# Altium schematic sheet MainCircuit.SchDoc: Bidirectional DC/DC Interleaved Buck Converter
size A3; DocumentNumber: 1; Revision: 1.1; SheetNumber: 1; SheetTotal: 6
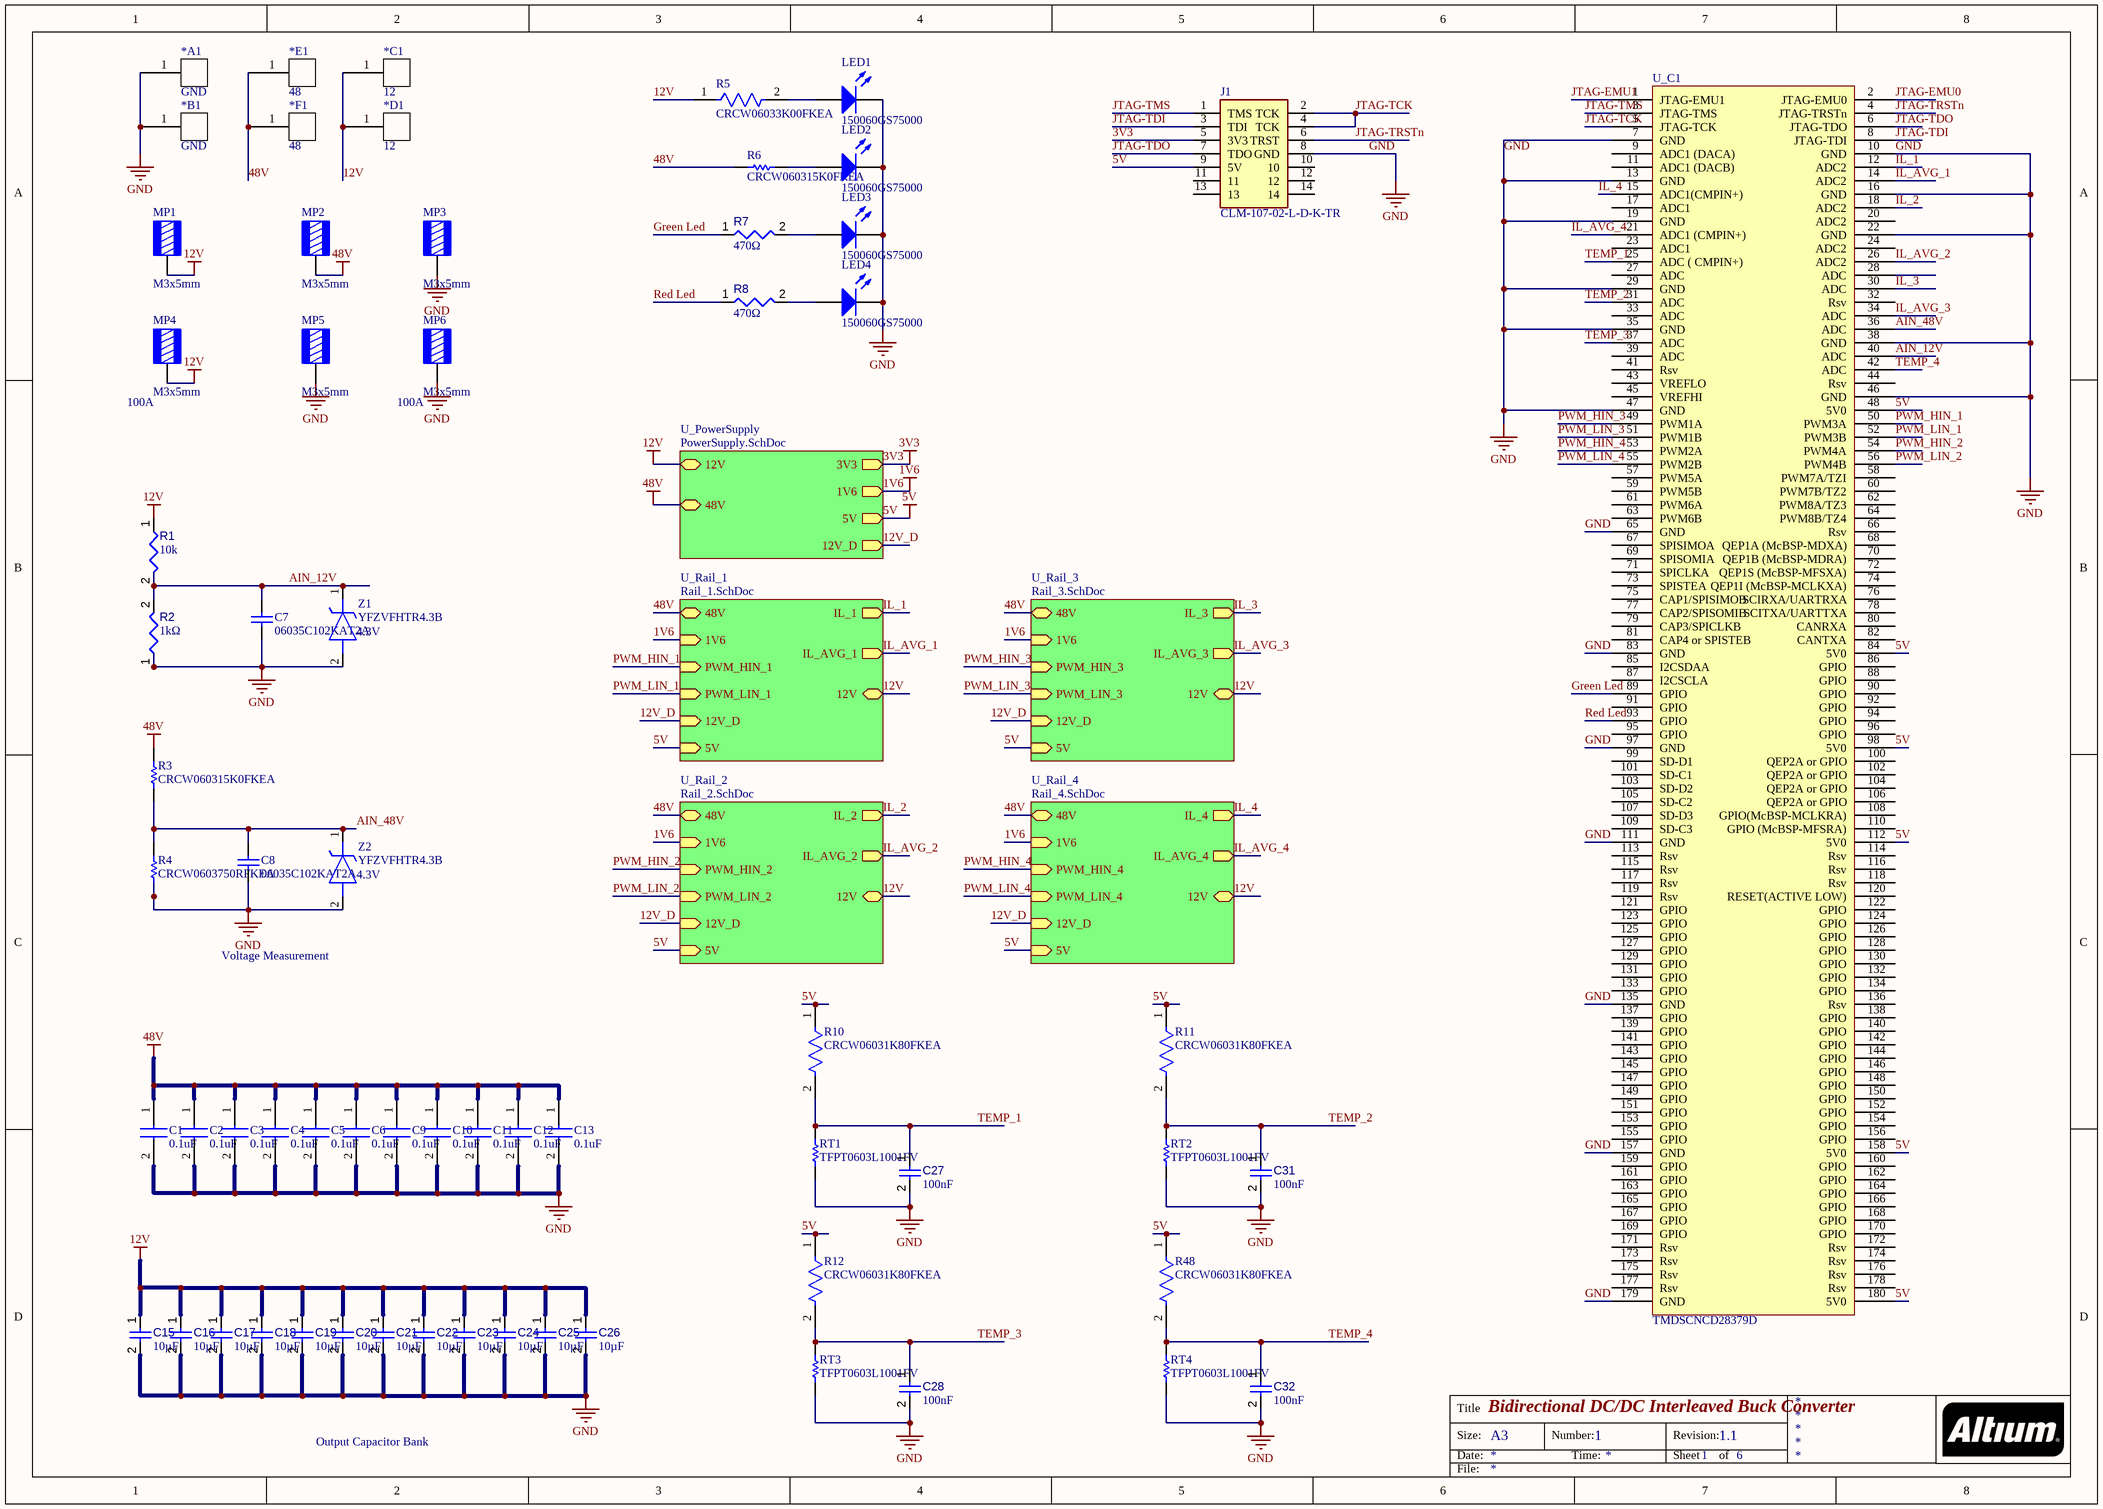
[diagram p0: MainCircuit.SchDoc]

## Parts
*A1  GND
*B1  GND
*C1  12
*D1  12
*E1  48
*F1  48
C1  0.1uF  [CAPC1608X90N]
C2  0.1uF  [CAPC1608X90N]
C3  0.1uF  [CAPC1608X90N]
C4  0.1uF  [CAPC1608X90N]
C5  0.1uF  [CAPC1608X90N]
C6  0.1uF  [CAPC1608X90N]
C7  06035C102KAT2A  [CAPC1608X90X35LL15T15]
C8  06035C102KAT2A  [CAPC1608X90X35LL15T15]
C9  0.1uF  [CAPC1608X90N]
C10  0.1uF  [CAPC1608X90N]
C11  0.1uF  [CAPC1608X90N]
C12  0.1uF  [CAPC1608X90N]
C13  0.1uF  [CAPC1608X90N]
C15  value 10µF  [CAPC0805(2012)145_L]  (hidden comment: Capacitor 10µF +/-20% 25V 0805)
C16  value 10µF  [CAPC0805(2012)145_L]  (hidden comment: Capacitor 10µF +/-20% 25V 0805)
C17  value 10µF  [CAPC0805(2012)145_L]  (hidden comment: Capacitor 10µF +/-20% 25V 0805)
C18  value 10µF  [CAPC0805(2012)145_L]  (hidden comment: Capacitor 10µF +/-20% 25V 0805)
C19  value 10µF  [CAPC0805(2012)145_L]  (hidden comment: Capacitor 10µF +/-20% 25V 0805)
C20  value 10µF  [CAPC0805(2012)145_L]  (hidden comment: Capacitor 10µF +/-20% 25V 0805)
C21  value 10µF  [CAPC0805(2012)145_L]  (hidden comment: Capacitor 10µF +/-20% 25V 0805)
C22  value 10µF  [CAPC0805(2012)145_L]  (hidden comment: Capacitor 10µF +/-20% 25V 0805)
C23  value 10µF  [CAPC0805(2012)145_L]  (hidden comment: Capacitor 10µF +/-20% 25V 0805)
C24  value 10µF  [CAPC0805(2012)145_L]  (hidden comment: Capacitor 10µF +/-20% 25V 0805)
C25  value 10µF  [CAPC0805(2012)145_L]  (hidden comment: Capacitor 10µF +/-20% 25V 0805)
C26  value 10µF  [CAPC0805(2012)145_L]  (hidden comment: Capacitor 10µF +/-20% 25V 0805)
C27  value 100nF  [CAPC1608X90X40ML10T20]  (hidden comment: Capacitor 100 nF +/-10% 50 V 0603)
C28  value 100nF  [CAPC1608X90X40ML10T20]  (hidden comment: Capacitor 100 nF +/-10% 50 V 0603)
C31  value 100nF  [CAPC1608X90X40ML10T20]  (hidden comment: Capacitor 100 nF +/-10% 50 V 0603)
C32  value 100nF  [CAPC1608X90X40ML10T20]  (hidden comment: Capacitor 100 nF +/-10% 50 V 0603)
J1  CLM-107-02-L-D-K-TR  [CLM-107-02-XX-D-Y-TR]
LED1  150060GS75000  [0603_A]
LED2  150060GS75000  [0603_A]
LED3  150060GS75000  [0603_A]
LED4  150060GS75000  [0603_A]
MP1  M3x5mm  [7461057_for chemical surfaces]
MP2  M3x5mm  [7461057_for chemical surfaces]
MP3  M3x5mm  [7461057_for chemical surfaces]
MP4  M3x5mm  [7461057_for chemical surfaces]
MP5  M3x5mm  [7461057_for chemical surfaces]
MP6  M3x5mm  [7461057_for chemical surfaces]
R1  value 10k  [RESC2013X50X35ML15T15]  (hidden comment: Resistor 10k +/-1% 0805 125 mW)
R2  value 1kΩ  [RESC0805(2012)_L]  (hidden comment: 1KR5J)
R3  CRCW060315K0FKEA  [RESC1609X50X30ML10T20]
R4  CRCW0603750RFKEA  [RESC1609X50X30LL10T20]
R5  CRCW06033K00FKEA  [FP-CRCW0603-e3-MFG]
R6  CRCW060315K0FKEA  [RESC1609X50X30ML10T20]
R7  value 470Ω  [RESC0805(2012)_L]  (hidden comment: 470R5J)
R8  value 470Ω  [RESC0805(2012)_L]  (hidden comment: 470R5J)
R10  CRCW06031K80FKEA  [FP-CRCW0603-e3-IPC_A]
R11  CRCW06031K80FKEA  [FP-CRCW0603-e3-IPC_A]
R12  CRCW06031K80FKEA  [FP-CRCW0603-e3-IPC_A]
R48  CRCW06031K80FKEA  [FP-CRCW0603-e3-IPC_A]
RT1  TFPT0603L1001FV  [RESC1609X55X30ML10T20]
RT2  TFPT0603L1001FV  [RESC1609X55X30ML10T20]
RT3  TFPT0603L1001FV  [RESC1609X55X30ML10T20]
RT4  TFPT0603L1001FV  [RESC1609X55X30ML10T20]
U_C1  TMDSCNCD28379D  [TMDSCNCD28379D-Footprint-1]
Z1  YFZVFHTR4.3B  [YFZVFHTR43B]
Z2  YFZVFHTR4.3B  [YFZVFHTR43B]

## Sub-sheets
U_PowerSupply = PowerSupply.SchDoc: 5V (out), 12V (bidir), 48V (bidir), 3V3 (out), 1V6 (out), 12V_D (out)
U_Rail_1 = Rail_1.SchDoc: IL_1 (out), 12V (bidir), IL_AVG_1 (out), 48V (bidir), PWM_LIN_1 (in), PWM_HIN_1 (in), 1V6 (in), 12V_D (in), 5V (in)
U_Rail_2 = Rail_2.SchDoc: IL_2 (out), 12V (bidir), IL_AVG_2 (out), 48V (bidir), PWM_HIN_2 (in), PWM_LIN_2 (in), 1V6 (in), 5V (in), 12V_D (in)
U_Rail_3 = Rail_3.SchDoc: IL_3 (out), 12V (bidir), IL_AVG_3 (out), 48V (bidir), PWM_LIN_3 (in), PWM_HIN_3 (in), 1V6 (in), 12V_D (in), 5V (in)
U_Rail_4 = Rail_4.SchDoc: IL_4 (out), 12V (bidir), IL_AVG_4 (out), 48V (bidir), PWM_HIN_4 (in), PWM_LIN_4 (in), 1V6 (in), 12V_D (in), 5V (in)

## Nets
1V6: sheet U_PowerSupply/1V6, sheet U_Rail_1/1V6, sheet U_Rail_2/1V6, sheet U_Rail_3/1V6, sheet U_Rail_4/1V6
3V3: J1.5(3V3) ; sheet U_PowerSupply/3V3
5V: J1.9(5V) R10.1 R11.1 R12.1 R48.1 U_C1.48(5V0) U_C1.84(5V0) U_C1.98(5V0) U_C1.112(5V0) U_C1.158(5V0) U_C1.180(5V0) ; sheet U_PowerSupply/5V, sheet U_Rail_1/5V, sheet U_Rail_2/5V, sheet U_Rail_3/5V, sheet U_Rail_4/5V
12V: *C1.1 *D1.1 C15.1 C16.1 C17.1 C18.1 C19.1 C20.1 C21.1 C22.1 C23.1 C24.1 C25.1 C26.1 MP1.1 MP4.1 R1.1 R5.1 ; sheet U_PowerSupply/12V, sheet U_Rail_1/12V, sheet U_Rail_2/12V, sheet U_Rail_3/12V, sheet U_Rail_4/12V
48V: *E1.1 *F1.1 C1.1 C2.1 C3.1 C4.1 C5.1 C6.1 C9.1 C10.1 C11.1 C12.1 C13.1 MP2.1 R3.2 R6.1 ; sheet U_PowerSupply/48V, sheet U_Rail_1/48V, sheet U_Rail_2/48V, sheet U_Rail_3/48V, sheet U_Rail_4/48V
GND: *A1.1 *B1.1 C1.2 C2.2 C3.2 C4.2 C5.2 C6.2 C7.1 C8.1 C9.2 C10.2 C11.2 C12.2 C13.2 C15.2 C16.2 C17.2 C18.2 C19.2 C20.2 C21.2 C22.2 C23.2 C24.2 C25.2 C26.2 C27.2 C28.2 C31.2 C32.2 J1.8(GND) LED1.1(K) LED2.1(K) LED3.1(K) LED4.1(K) MP3.1 MP5.1 MP6.1 R2.1 R4.1 RT1.2 RT2.2 RT3.2 RT4.2 U_C1.7(GND) U_C1.10(GND) U_C1.13(GND) U_C1.16(GND) U_C1.19(GND) U_C1.22(GND) U_C1.29(GND) U_C1.35(GND) U_C1.38(GND) U_C1.46(GND) U_C1.47(GND) U_C1.65(GND) U_C1.83(GND) U_C1.97(GND) U_C1.111(GND) U_C1.135(GND) U_C1.157(GND) U_C1.179(GND) Z1.2(A) Z2.2(A)
12V_D: sheet U_PowerSupply/12V_D, sheet U_Rail_1/12V_D, sheet U_Rail_2/12V_D, sheet U_Rail_3/12V_D, sheet U_Rail_4/12V_D
AIN_12V: C7.2 R1.2 R2.2 U_C1.40(ADC) Z1.1(K)
AIN_48V: C8.2 R3.1 R4.2 U_C1.36(ADC) Z2.1(K)
Green Led: R7.1 U_C1.89(GPIO)
IL_1: U_C1.12(ADC2) ; sheet U_Rail_1/IL_1
IL_2: U_C1.18(ADC2) ; sheet U_Rail_2/IL_2
IL_3: U_C1.30(ADC) ; sheet U_Rail_3/IL_3
IL_4: U_C1.15(ADC1(CMPIN+)) ; sheet U_Rail_4/IL_4
IL_AVG_1: U_C1.14(ADC2) ; sheet U_Rail_1/IL_AVG_1
IL_AVG_2: U_C1.26(ADC2) ; sheet U_Rail_2/IL_AVG_2
IL_AVG_3: U_C1.34(ADC) ; sheet U_Rail_3/IL_AVG_3
IL_AVG_4: U_C1.21(ADC1_(CMPIN+)) ; sheet U_Rail_4/IL_AVG_4
JTAG-EMU0: U_C1.2(JTAG-EMU0)
JTAG-EMU1: U_C1.1(JTAG-EMU1)
JTAG-TCK: J1.2(TCK) J1.4(TCK) U_C1.5(JTAG-TCK)
JTAG-TDI: J1.3(TDI) U_C1.8(JTAG-TDI)
JTAG-TDO: J1.7(TDO) U_C1.6(JTAG-TDO)
JTAG-TMS: J1.1(TMS) U_C1.3(JTAG-TMS)
JTAG-TRSTn: J1.6(TRST) U_C1.4(JTAG-TRSTn)
PWM_HIN_1: U_C1.50(PWM3A) ; sheet U_Rail_1/PWM_HIN_1
PWM_HIN_2: U_C1.54(PWM4A) ; sheet U_Rail_2/PWM_HIN_2
PWM_HIN_3: U_C1.49(PWM1A) ; sheet U_Rail_3/PWM_HIN_3
PWM_HIN_4: U_C1.53(PWM2A) ; sheet U_Rail_4/PWM_HIN_4
PWM_LIN_1: U_C1.52(PWM3B) ; sheet U_Rail_1/PWM_LIN_1
PWM_LIN_2: U_C1.56(PWM4B) ; sheet U_Rail_2/PWM_LIN_2
PWM_LIN_3: U_C1.51(PWM1B) ; sheet U_Rail_3/PWM_LIN_3
PWM_LIN_4: U_C1.55(PWM2B) ; sheet U_Rail_4/PWM_LIN_4
Red Led: R8.1 U_C1.93(GPIO)
TEMP_1: C27.1 R10.2 RT1.1 U_C1.25(ADC_(_CMPIN+))
TEMP_2: C31.1 R11.2 RT2.1 U_C1.31(ADC)
TEMP_3: C28.1 R12.2 RT3.1 U_C1.37(ADC)
TEMP_4: C32.1 R48.2 RT4.1 U_C1.42(ADC)
NetLED1_2: LED1.2(A) R5.2
NetLED2_2: LED2.2(A) R6.2
NetLED3_2: LED3.2(A) R7.2
NetLED4_2: LED4.2(A) R8.2

Not connected (* = marked no-connect by the designer): J1 10 11 12 13 14; U_C1 9(ADC1_(DACA)) 11(ADC1_(DACB)) 17(ADC1) 20(ADC2) 23(ADC1) 24(ADC2) 27(ADC) 28(ADC) 32(Rsv) 33(ADC) 39(ADC) 41(Rsv) 43(VREFLO) 44(Rsv) 45(VREFHI) 57(PWM5A) 58(PWM7A/TZI) 59(PWM5B) 60(PWM7B/TZ2) 61(PWM6A) 62(PWM8A/TZ3) 63(PWM6B) 64(PWM8B/TZ4) 66(Rsv) 67(SPISIMOA) 68(QEP1A_(McBSP-MDXA)) 69(SPISOMIA) 70(QEP1B_(McBSP-MDRA)) 71(SPICLKA) 72(QEP1S_(McBSP-MFSXA)) 73(SPISTEA) 74(QEP1I_(McBSP-MCLKXA)) 75(CAP1/SPISIMOB) 76(SCIRXA/UARTRXA) 77(CAP2/SPISOMIB) 78(SCITXA/UARTTXA) 79(CAP3/SPICLKB) 80(CANRXA) 81(CAP4_or_SPISTEB) 82(CANTXA) 85(I2CSDAA) 86(GPIO) 87(I2CSCLA) 88(GPIO) 90(GPIO) 91(GPIO) 92(GPIO) 94(GPIO) 95(GPIO) 96(GPIO) 99(SD-D1) 100(QEP2A_or_GPIO) 101(SD-C1) 102(QEP2A_or_GPIO) 103(SD-D2) 104(QEP2A_or_GPIO) 105(SD-C2) 106(QEP2A_or_GPIO) 107(SD-D3) 108(GPIO(McBSP-MCLKRA)) 109(SD-C3) 110(GPIO_(McBSP-MFSRA)) 113(Rsv) 114(Rsv) 115(Rsv) 116(Rsv) 117(Rsv) 118(Rsv) 119(Rsv) 120(RESET(ACTIVE_LOW)) 121(GPIO) 122(GPIO) 123(GPIO) 124(GPIO) 125(GPIO) 126(GPIO) 127(GPIO) 128(GPIO) 129(GPIO) 130(GPIO) 131(GPIO) 132(GPIO) 133(GPIO) 134(GPIO) 136(Rsv) 137(GPIO) 138(GPIO) 139(GPIO) 140(GPIO) 141(GPIO) 142(GPIO) 143(GPIO) 144(GPIO) 145(GPIO) 146(GPIO) 147(GPIO) 148(GPIO) 149(GPIO) 150(GPIO) 151(GPIO) 152(GPIO) 153(GPIO) 154(GPIO) 155(GPIO) 156(GPIO) 159(GPIO) 160(GPIO) 161(GPIO) 162(GPIO) 163(GPIO) 164(GPIO) 165(GPIO) 166(GPIO) 167(GPIO) 168(GPIO) 169(GPIO) 170(GPIO) 171(Rsv) 172(Rsv) 173(Rsv) 174(Rsv) 175(Rsv) 176(Rsv) 177(Rsv) 178(Rsv)

## Notes on the sheet
- (near MP4) 100A
- (near MP6) 100A
- (near Z1) 4.3V
- (near Z2) 4.3V
- Voltage Measurement
- Output Capacitor Bank
- Title
- Size:
- Date:
- A3
- Number:
- Time:
- Revision:
- Sheet
- of
- File:

## Library data of the parts
*A1 *B1 *C1 *D1 *E1 *F1 = CMP-002-00073-1: Power Pad for Ground and Supply
C1-C6 C9-C13 = 06031C104K4T2A: Capacitor; Manufacturer_Name: AVX; Datasheet Link: https://componentsearchengine.com/Datasheets/1/06031A100FAT2A.pdf; Height: 0.9mm; Manufacturer_Part_Number: 06031C104K4T2A; Mouser Part Number: 581-06031C104K4T2A; Mouser Price/Stock: https://www.mouser.co.uk/ProductDetail/AVX/06031C104K4T2A?qs=7MVldsJ5UaycASOsZ6%2FbJQ%3D%3D
C7 C8 = CMP-2006-04378-1: Manufacturer: AVX Interconnect / Elco; Part Number: 06035C102KAT2A
C15-C26 = CMP-001-00079-2: Chip Capacitor, 10µF +/-20%, 25V, 0805, Thickness 1.45 mm; Tolerance: 10%; Pins: 2; Max Operating Temperature: 85°C; Mounting Technology: SMT; Case/Package: 0603; Voltage Rating: 25V; Min Operating Temperature: -55°C
C27 C28 C31 C32 = CMP-001-00017-4: Chip Capacitor, 100 nF, +/- 10%, 50 V, 0603 (1608 Metric); Capacitor Type: Ceramic; Voltage Rating: 50V; RoHS Compliant: True; Max Operating Temperature: 125°C; Pins: 2; Mounting Technology: SM; Min Operating Temperature: -55°C; Tolerance: 10%; Case/Package: 0603
J1 = CLM-107-02-L-D-K-TR: Connector; Manufacturer_Name: SAMTEC; Datasheet Link: http://suddendocs.samtec.com/prints/clm-1xx-xx-xx-d-xx-mkt.pdf; Manufacturer_Part_Number: CLM-107-02-L-D-K-TR; Arrow Part Number: CLM-107-02-L-D-K-TR; Arrow Price/Stock: https://www.arrow.com/en/products/clm-107-02-l-d-k-tr/samtec; Mouser Part Number: 200-CLM10702LDKTR; Mouser Price/Stock: https://www.mouser.co.uk/ProductDetail/Samtec/CLM-107-02-L-D-K-TR?qs=0lQeLiL1qyaVnfWTja1Tqg%3D%3D
LED1-LED4 = CMP-1426-00002-1: SMD mono-color Chip LED, WL-SMCW, Green; Manufacturer: Wuerth Elektronik; ComponentLink1URL: http://www.we-online.com; ComponentLink2Description: Datasheet; Color: Green; ComponentLink2URL: http://katalog.we-online.com/led/datasheet/150060GS75000.pdf; PartNumber: 150060GS75000; PackageReference: 0603_A; ComponentLink1Description: Manufacturer URL
MP1-MP6 = 7461057: WP-BUTR Press-Fit with Internal thread, two rows, 7x7mm, 6 pins, M3x5mm, 100A; Pin Number: 6; Thread Length: 5mm; Thread: M3; Surface: Tin; ComponentLink1Description: Manufacturer; ComponentLink1URL: http://www.we-online.de; ComponentLink2Description: Datasheet; ComponentLink2URL: https://katalog.we-online.com/em/datasheet/7461057.pdf; Operating Temperature: -55 to +150degC; Height: 6mm; Material: Brass; Part Number: 7461057; Packaging: Bulk; Mounting Technology: Press-Fit; Rated Current: 100A; Publisher: Wurth Elektronik; Published Date: September 2019; Size: 7x7mm
R1 = CMP-009-00018-4: Chip Resistor, 10 KOhm, +/- 1%, 125 mW, -55 to 155 degC, 0805 (2012 Metric); Power: 125mW; Voltage Rating: 150V; RoHS Compliant: True; Mounting Technology: SM; Pins: 2; Case/Package: 0603; Min Operating Temperature: -55°C; Max Operating Temperature: 155°C; Tolerance: 1%
R2 = CMP-009-00076-1: 1K 0.125W 5% 0805 (2012 Metric)  SMD; Mounting Technology: SMT; Power: 0.125W; Pins: 2; Case/Package: 0603; Tolerance: 5%
R3 R6 = CMP-2000-02920-1: Manufacturer: Vishay Dale; Part Number: CRCW060315K0FKEA
R4 = CMP-2000-03568-1: Manufacturer: Vishay Dale; Part Number: CRCW0603750RFKEA
R5 = CMP-02407-003384-1: RES Thick Film, 3kΩ, 1%, 0.1W, 100ppm/°C, 0603; Voltage Rating: 75V; Resistance: 3kR; Power Rating: 100mW; Features: Automotive AEC-Q200; Radiation Hardening: No; Contact Plating: Tin; Termination: SMD/SMT; Lead Free: Lead Free; Case Code (Imperial): 0603; Case Code (Metric): 1608; Case/Package: 0603; Depth: 0.85mm; Mount: Surface Mount; Voltage Rating (DC): 75V; Tolerance: 1%; Package Quantity: 10; Temperature Coefficient: 100ppm/°C; Height: 0.45mm; Max Power Dissipation: 100mW; Composition: Thick Film; Max Operating Temperature: 155°C; Military Standard: Not; Weight: 7.1E-05oz; Length: 1.55mm; Packaging: Tape and Reel; Number of Terminations: 2; Width: 0.85mm; Min Operating Temperature: -55°C
R7 R8 = CMP-009-00102-1: 470R 0.125W 5% 0805 (2012 Metric)  SMD; Power: 0.125W; Tolerance: 5%; Mounting Technology: SMT; Pins: 2
  R7: Case/Package: 0603
  R8: Case/Package: 0402
R10-R12 R48 = CMP-02407-005782-1: RES Thick Film, 1.8kΩ, 1%, 0.1W, 100ppm/°C, 0603; Voltage Rating (DC): 75V; Max Power Dissipation: 100mW; Resistance: 1.8kR; Depth: 0.85mm; Contact Plating: Tin; Max Operating Temperature: 155°C; Package Quantity: 5000; Radiation Hardening: No; Temperature Coefficient: 100ppm/°C; Packaging: Tape and Reel; Number of Terminations: 2; Case Code (Imperial): 0603; Lead Free: Lead Free; Case/Package: 0603; Military Standard: Not; Weight: 7.1E-05oz; Tolerance: 1%; Height: 0.45mm; Min Operating Temperature: -55°C; Length: 1.55mm; Voltage Rating: 75V; Power Rating: 100mW; Width: 0.033inch; Composition: Thick Film; Case Code (Metric): 1608; Termination: SMD/SMT; Features: Automotive AEC-Q200
RT1-RT4 = CMP-2000-03675-1: Manufacturer: Vishay Dale; Part Number: TFPT0603L1001FV
U_C1 = CMP-020-00024-7: F28379D CONTROLCARD FOR C2000 RE; Evaluation Kit: Yes
Z1 Z2 = YFZVFHTR4.3B: Zener Diode; Manufacturer_Name: ROHM Semiconductor; Datasheet Link: https://componentsearchengine.com/Datasheets/2/YFZVFHTR4.3B.pdf; Height: 0.8mm; Manufacturer_Part_Number: YFZVFHTR4.3B; Mouser Part Number: 755-YFZVFHTR4.3B; Mouser Price/Stock: https://www.mouser.co.uk/ProductDetail/ROHM-Semiconductor/YFZVFHTR43B?qs=4v%252BiZTmLVHGVnMzHBrJLew%3D%3D